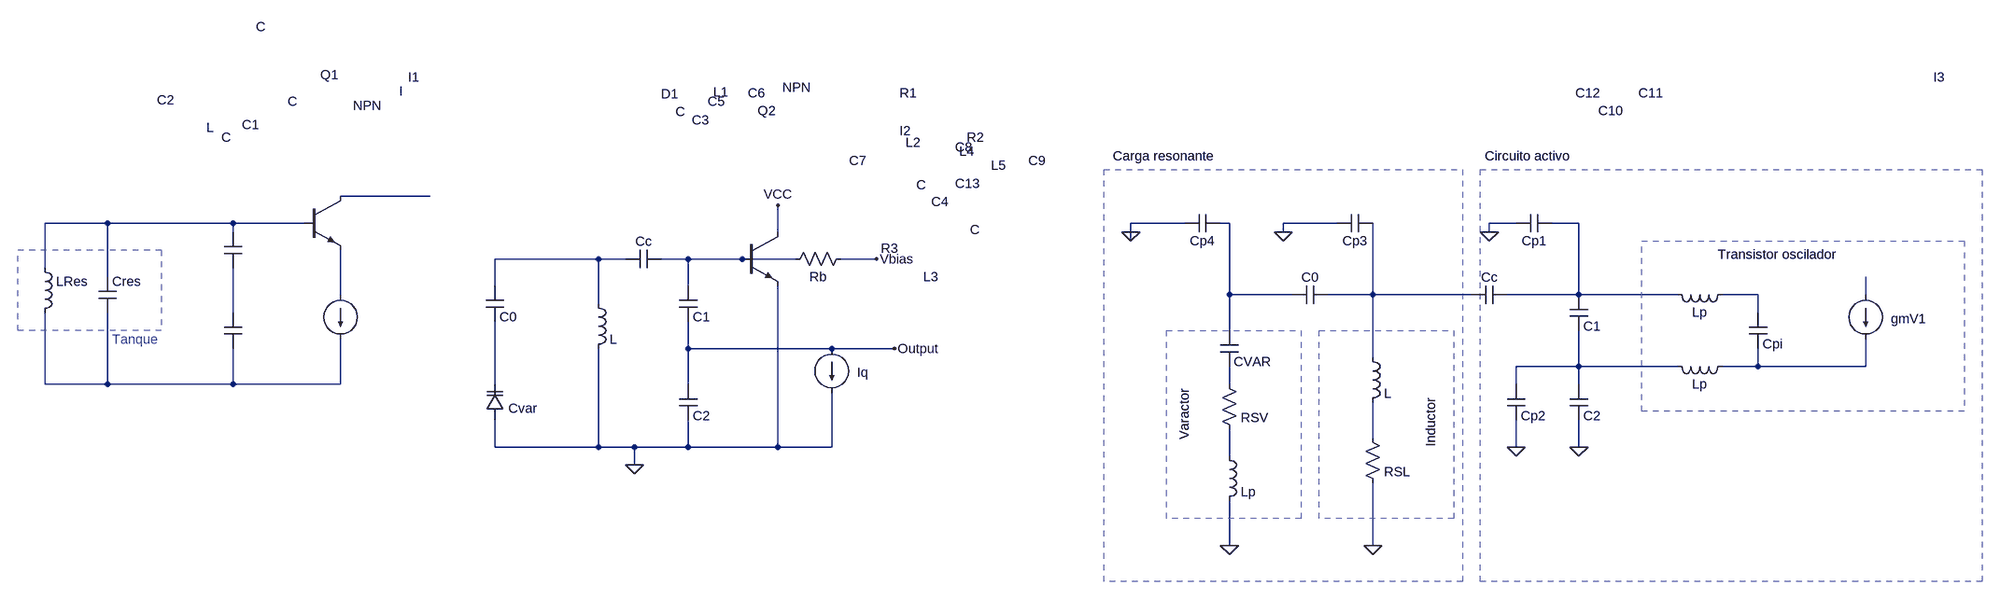
[diagram p0: schematic FotoInforme.asc]
FotoInforme.asc, the LTspice schematic file:
Version 4
SHEET 1 3700 692
WIRE 480 0 320 0
WIRE -96 48 -208 48
WIRE 128 48 -96 48
WIRE 256 48 128 48
WIRE 2272 48 2176 48
WIRE 2352 48 2336 48
WIRE 2544 48 2448 48
WIRE 2864 48 2816 48
WIRE 2976 48 2928 48
WIRE 128 64 128 48
WIRE 1536 64 1536 16
WIRE 2176 64 2176 48
WIRE 2448 64 2448 48
WIRE 2816 64 2816 48
WIRE 2176 80 2176 64
WIRE 1216 112 1024 112
WIRE 1264 112 1216 112
WIRE 1376 112 1328 112
WIRE 1472 112 1376 112
WIRE 1568 112 1472 112
WIRE 1712 112 1648 112
WIRE -208 128 -208 48
WIRE -96 144 -96 48
WIRE 1024 160 1024 112
WIRE 1376 160 1376 112
WIRE 320 176 320 96
WIRE 2352 176 2352 48
WIRE 2464 176 2352 176
WIRE 2608 176 2608 48
WIRE 2608 176 2528 176
WIRE 2784 176 2608 176
WIRE 2976 176 2976 48
WIRE 2976 176 2848 176
WIRE 3152 176 2976 176
WIRE 3296 176 3232 176
WIRE 3488 176 3488 144
WIRE 1216 192 1216 112
WIRE 2976 192 2976 176
WIRE 128 208 128 128
WIRE 3296 208 3296 176
WIRE 2352 240 2352 176
WIRE 1376 272 1376 224
WIRE 1632 272 1376 272
WIRE 1744 272 1632 272
WIRE 2608 288 2608 176
WIRE 2976 304 2976 240
WIRE 2976 304 2864 304
WIRE 3152 304 2976 304
WIRE 3296 304 3296 272
WIRE 3296 304 3232 304
WIRE 3488 304 3488 256
WIRE 3488 304 3296 304
WIRE -208 336 -208 208
WIRE -96 336 -96 208
WIRE -96 336 -208 336
WIRE 128 336 128 272
WIRE 128 336 -96 336
WIRE 320 336 320 256
WIRE 320 336 128 336
WIRE 1024 336 1024 224
WIRE 1376 336 1376 272
WIRE 2352 336 2352 304
WIRE 2864 336 2864 304
WIRE 2976 336 2976 304
WIRE 2608 432 2608 368
WIRE 1024 448 1024 400
WIRE 1216 448 1216 272
WIRE 1216 448 1024 448
WIRE 1280 448 1216 448
WIRE 1376 448 1376 400
WIRE 1376 448 1280 448
WIRE 1536 448 1536 160
WIRE 1536 448 1376 448
WIRE 1632 448 1632 352
WIRE 1632 448 1536 448
WIRE 2864 448 2864 400
WIRE 2976 448 2976 400
WIRE 2352 464 2352 416
WIRE 1280 480 1280 448
WIRE 2352 624 2352 544
WIRE 2608 624 2608 512
FLAG 1536 16 VCC
FLAG 1280 480 0
FLAG 1744 272 Output
FLAG 1712 112 Vbias
FLAG 2176 64 0
FLAG 2448 64 0
FLAG 2608 624 0
FLAG 2352 624 0
FLAG 2816 64 0
FLAG 2864 448 0
FLAG 2976 448 0
SYMBOL cap 112 64 R0
WINDOW 0 32 -192 Left 2
WINDOW 3 114 -233 Left 2
SYMATTR InstName C1
SYMBOL cap 112 208 R0
WINDOW 0 -120 -380 Left 2
WINDOW 3 57 -511 Left 2
SYMATTR InstName C2
SYMBOL ind -224 112 R0
WINDOW 3 305 -235 Left 2
SYMATTR InstName LRes
SYMBOL cap -112 144 R0
WINDOW 3 219 -249 Left 2
SYMATTR InstName Cres
SYMBOL current 320 176 R0
WINDOW 0 121 -389 Left 2
WINDOW 3 105 -364 Left 2
SYMATTR InstName I1
SYMBOL npn 256 0 R0
WINDOW 0 28 -217 Left 2
WINDOW 3 86 -162 Left 2
SYMATTR InstName Q1
SYMBOL varactor 1040 400 R180
WINDOW 0 -318 583 Left 2
WINDOW 3 -59 21 Left 2
SYMATTR InstName D1
SYMATTR Value Cvar
SYMBOL cap 1008 160 R0
WINDOW 0 374 -296 Left 2
SYMATTR InstName C3
SYMATTR Value C0
SYMBOL ind 1200 176 R0
WINDOW 0 221 -362 Left 2
SYMATTR InstName L1
SYMBOL cap 1328 96 R90
WINDOW 0 0 32 VBottom 2
WINDOW 3 -263 -34 VTop 2
SYMATTR InstName Cc
SYMBOL cap 1360 160 R0
WINDOW 0 51 -329 Left 2
SYMATTR InstName C5
SYMATTR Value C1
SYMBOL cap 1360 336 R0
WINDOW 0 122 -520 Left 2
SYMATTR InstName C6
SYMATTR Value C2
SYMBOL current 1632 272 R0
WINDOW 0 121 -389 Left 2
WINDOW 3 45 43 Left 2
WINDOW 123 0 0 Left 0
WINDOW 39 0 0 Left 0
SYMATTR InstName I2
SYMATTR Value Iq
SYMBOL res 1664 96 R90
WINDOW 0 -265 -105 VBottom 2
WINDOW 3 32 56 VTop 2
SYMATTR InstName R1
SYMATTR Value Rb
SYMBOL npn 1472 64 R0
WINDOW 0 28 -217 Left 2
WINDOW 3 72 -258 Left 2
SYMATTR InstName Q2
SYMBOL cap 2336 32 R90
WINDOW 0 -7 511 VBottom 2
WINDOW 3 32 32 VTop 2
SYMATTR InstName C4
SYMATTR Value Cp4
SYMBOL cap 2608 32 R90
WINDOW 0 -80 929 VBottom 2
WINDOW 3 32 32 VTop 2
SYMATTR InstName C7
SYMATTR Value Cp3
SYMBOL cap 2528 160 R90
WINDOW 0 0 32 VBottom 2
WINDOW 3 -196 736 VTop 2
SYMATTR InstName C0
SYMBOL cap 2336 240 R0
WINDOW 0 -484 -328 Left 2
SYMATTR InstName C8
SYMATTR Value CVAR
SYMBOL res 2336 320 R0
WINDOW 0 -463 -425 Left 2
SYMATTR InstName R2
SYMATTR Value RSV
SYMBOL ind 2336 448 R0
WINDOW 0 -572 -544 Left 2
SYMATTR InstName L2
SYMATTR Value Lp
SYMBOL ind 2592 272 R0
WINDOW 0 -796 -128 Left 2
SYMATTR InstName L3
SYMBOL res 2592 416 R0
WINDOW 0 -872 -323 Left 2
SYMATTR InstName R3
SYMATTR Value RSL
SYMBOL cap 2848 160 R90
WINDOW 0 0 32 VBottom 2
WINDOW 3 -116 960 VTop 2
SYMATTR InstName Cc
SYMBOL cap 2928 32 R90
WINDOW 0 -80 929 VBottom 2
WINDOW 3 32 32 VTop 2
SYMATTR InstName C9
SYMATTR Value Cp1
SYMBOL cap 2960 176 R0
WINDOW 0 51 -329 Left 2
SYMATTR InstName C10
SYMATTR Value C1
SYMBOL cap 2960 336 R0
WINDOW 0 122 -520 Left 2
SYMATTR InstName C11
SYMATTR Value C2
SYMBOL cap 2848 336 R0
WINDOW 0 122 -520 Left 2
SYMATTR InstName C12
SYMATTR Value Cp2
SYMBOL ind 3248 160 R90
WINDOW 0 -225 1375 VBottom 2
WINDOW 3 32 56 VTop 2
SYMATTR InstName L4
SYMATTR Value Lp
SYMBOL ind 3248 288 R90
WINDOW 0 -328 1318 VBottom 2
WINDOW 3 32 56 VTop 2
SYMATTR InstName L5
SYMATTR Value Lp
SYMBOL cap 3280 208 R0
WINDOW 0 -1428 -231 Left 2
SYMATTR InstName C13
SYMATTR Value Cpi
SYMBOL current 3488 176 R0
WINDOW 0 121 -389 Left 2
WINDOW 3 45 43 Left 2
WINDOW 123 0 0 Left 0
WINDOW 39 0 0 Left 0
SYMATTR InstName I3
SYMATTR Value gmV1
TEXT -88 256 Left 2 ;Tanque
TEXT 2144 -72 Left 2 !Carga resonante
TEXT 2808 -72 Left 2 !Circuito activo
TEXT 2712 360 VRight 2 !Inductor
TEXT 2272 344 VRight 2 !Varactor
TEXT 3224 104 Left 2 !Transistor oscilador
RECTANGLE Normal 0 240 -256 96 2
RECTANGLE Normal 2480 576 2240 240 2
RECTANGLE Normal 2752 576 2512 240 2
RECTANGLE Normal 3664 384 3088 80 2
RECTANGLE Normal 2768 688 2128 -48 2
RECTANGLE Normal 2768 688 2128 -48 2
RECTANGLE Normal 3696 688 2800 -48 2

The netlist it stands for:
* FotoInforme.asc
C1 N002 N011 C
C2 N011 N014 C
LRes N002 N014 L
Cres N002 N014 C
I1 N007 N014 I
Q1 N001 N002 N007 0 NPN
D1 0 N015 Cvar
C3 N005 N015 C0
L1 N005 0 L
Cc N006 N005 C
C5 N006 Output C1
C6 Output 0 C2
I2 Output 0 Iq
R1 Vbias N006 Rb
Q2 VCC N006 0 0 NPN
C4 N003 0 Cp4
C7 N008 0 Cp3
C0 N008 N003 C
C8 N003 N016 CVAR
R2 N016 N018 RSV
L2 N018 0 Lp
L3 N008 N017 L
R3 N017 0 RSL
Cc N004 N008 C
C9 N004 0 Cp1
C10 N004 N012 C1
C11 N012 0 C2
C12 N012 0 Cp2
L4 N009 N004 Lp
L5 N013 N012 Lp
C13 N009 N013 Cpi
I3 N010 N013 gmV1
.model D D
.lib standard.dio
.model NPN NPN
.model PNP PNP
.lib standard.bjt
* Tanque
Carga resonante
Circuito activo
Inductor
Varactor
Transistor oscilador
.backanno
.end